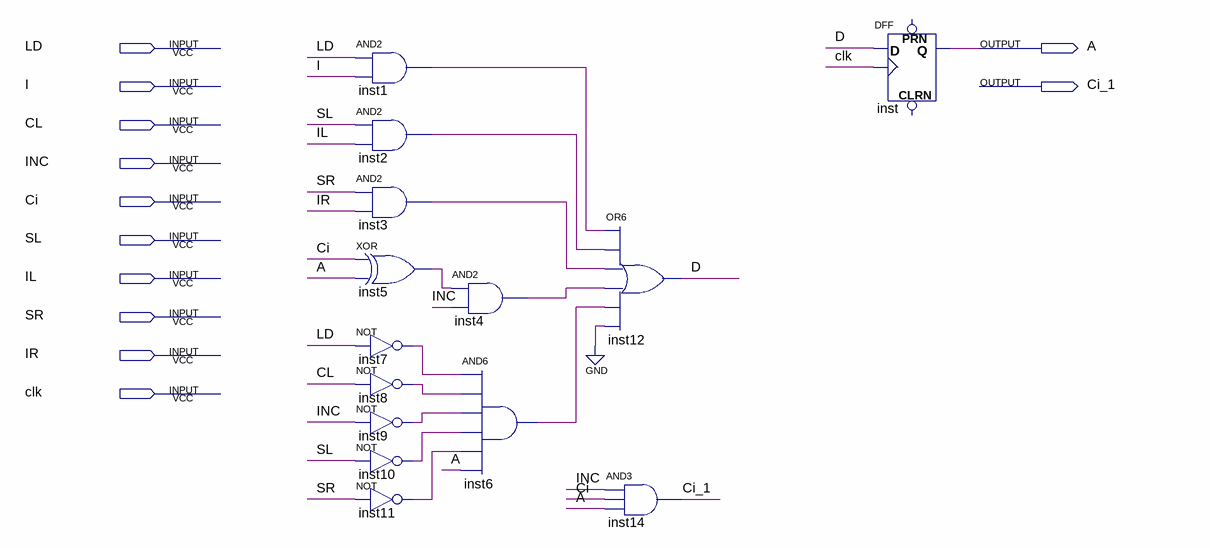
[diagram p0: schematic sheet]
// Quartus schematic REG1_LD_CL_INC_SL_SR.bdf as structural Verilog: 14 symbols, 12 pins
module REG1_LD_CL_INC_SL_SR (
  input  LD,
  input  I,
  input  CL,
  input  INC,
  input  Ci,
  input  SL,
  input  IL,
  input  SR,
  input  IR,
  input  clk,
  output A,
  output Ci_1
);

  wire D, inst1_out, inst2_out, inst3_out, inst4_out, inst5_out, inst6_out, inst7_out, inst8_out, inst9_out,
       inst10_out, inst11_out;

  and inst1 (inst1_out, LD, I);
  and inst2 (inst2_out, SL, IL);
  and inst3 (inst3_out, SR, IR);
  xor inst5 (inst5_out, Ci, A);
  not inst7 (inst7_out, LD);
  not inst8 (inst8_out, CL);
  not inst9 (inst9_out, INC);
  not inst10 (inst10_out, SL);
  not inst11 (inst11_out, SR);
  and inst4 (inst4_out, inst5_out, INC);
  and inst6 (inst6_out, inst7_out, inst8_out, inst9_out, inst10_out, inst11_out, A);
  or inst12 (D, inst1_out, inst2_out, inst3_out, inst4_out, inst6_out, 1'b0);
  and inst14 (Ci_1, INC, Ci, A);
  DFF inst (.CLK(clk), .D(D), .Q(A));  // open: CLRN, PRN
endmodule
